# EAGLE design DigitalLevel (EAGLE 9.6.2)
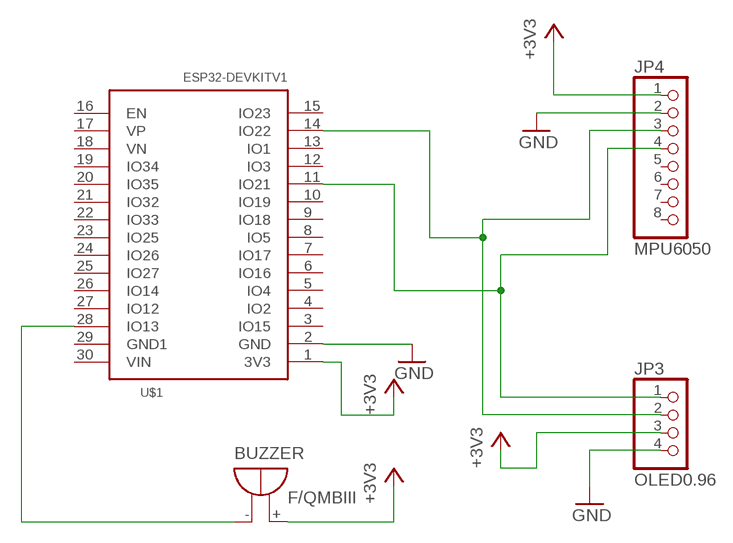
[diagram p0: schematic, sheet 1]

## Parts
BUZZER  F/QMBIII  [F/QMBIII]
JP3  OLED0.96  PINHD-1X4  [1X04]
JP4  MPU6050  PINHD-1X8  [1X08]
U$1  ESP32DEVKITV1  [ESP32-DEVKITV1]

## Nets
+3V3: BUZZER.+(-) JP3.3 JP4.1 U$1.1(3V3)
GND: JP3.4 JP4.2 U$1.2(GND)
N$1: BUZZER.-(+) U$1.28(IO13)
N$3: JP3.1 JP4.4 U$1.11(IO21)
N$4: JP3.2 JP4.3 U$1.14(IO22)
Unconnected: JP4.5 JP4.6 JP4.7 JP4.8 U$1.3(IO15) U$1.4(IO2) U$1.5(IO4) U$1.6(IO16) U$1.7(IO17) U$1.8(IO5) U$1.9(IO18) U$1.10(IO19) U$1.12(IO3) U$1.13(IO1) U$1.15(IO23) U$1.16(EN) U$1.17(VP) U$1.18(VN) U$1.19(IO34) U$1.20(IO35) U$1.21(IO32) U$1.22(IO33) U$1.23(IO25) U$1.24(IO26) U$1.25(IO27) U$1.26(IO14) U$1.27(IO12) U$1.29(GND1) U$1.30(VIN)

## Library data of the parts
BUZZER = buzzer:F/QMBIII: BUZZER Source: Buerklin; OC_FARNELL: unknown; OC_NEWARK: unknown
JP3 = pinhead:PINHD-1X4: PIN HEADER
JP4 = pinhead:PINHD-1X8: PIN HEADER
U$1 = ESP32-DEVKITV1:ESP32DEVKITV1

## Board
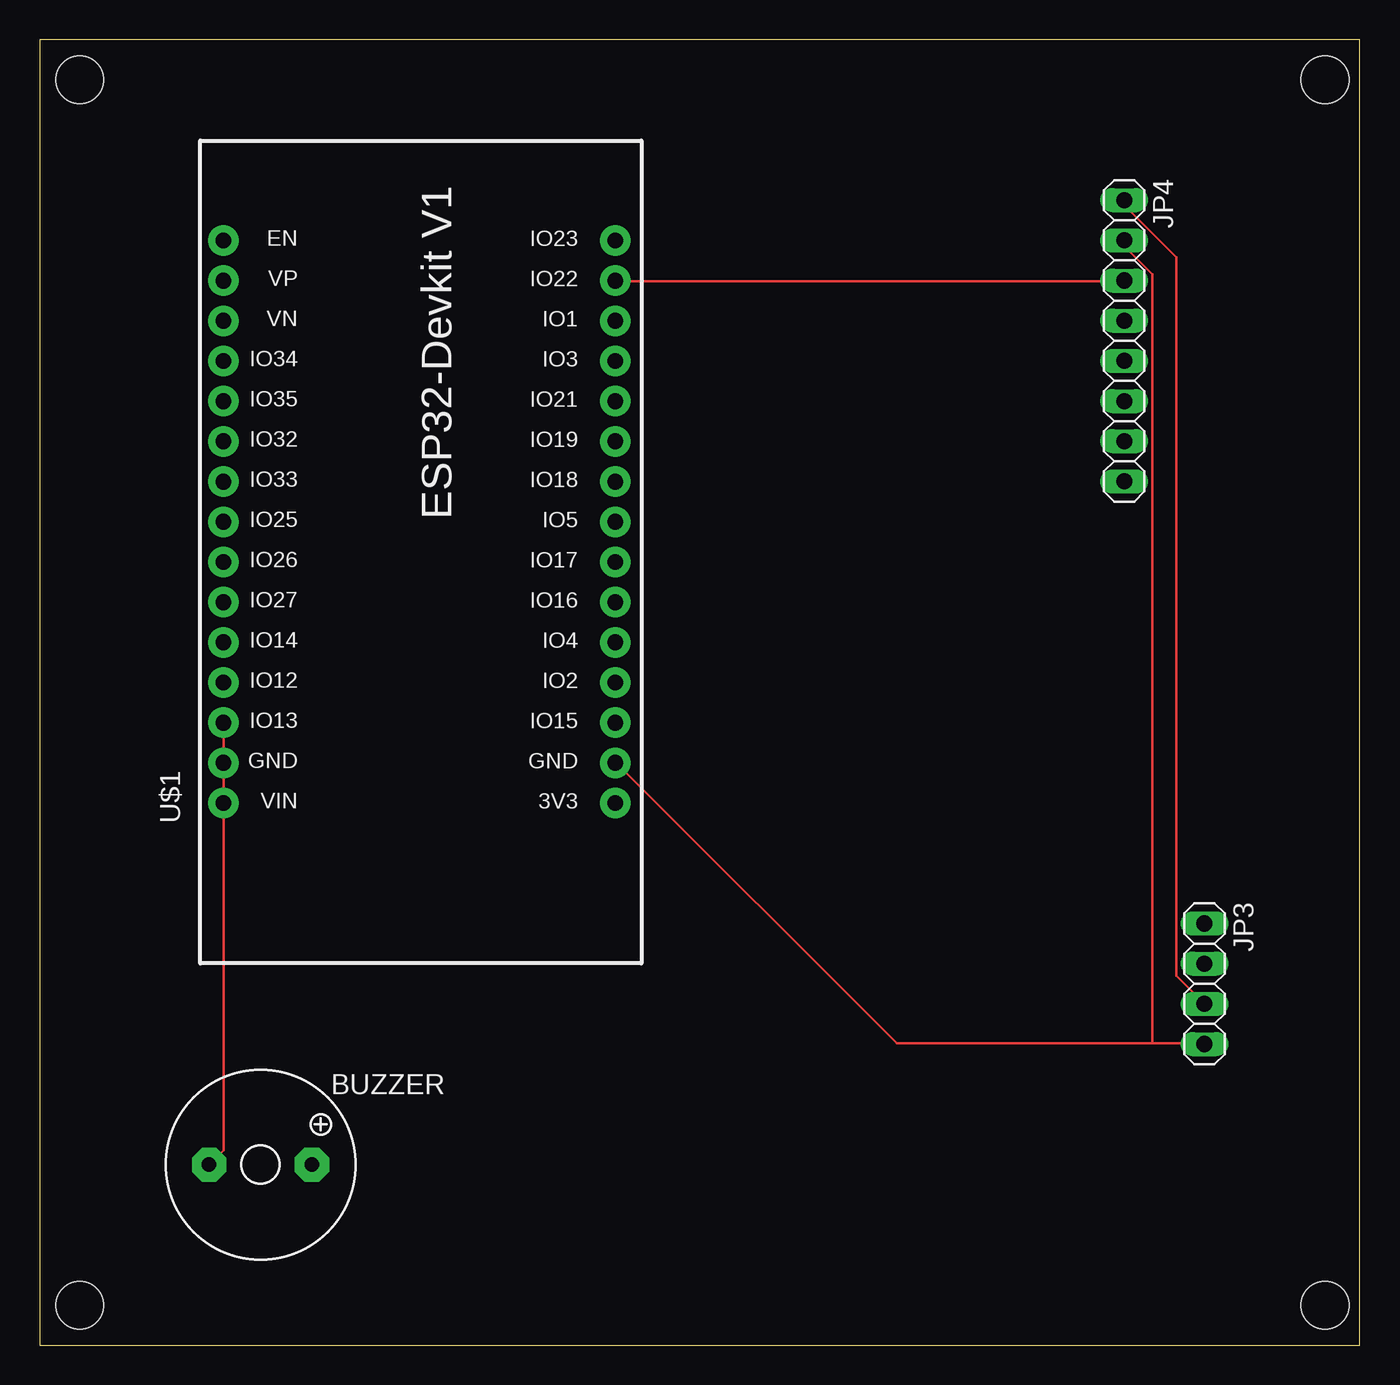
[diagram p1: board, top side]
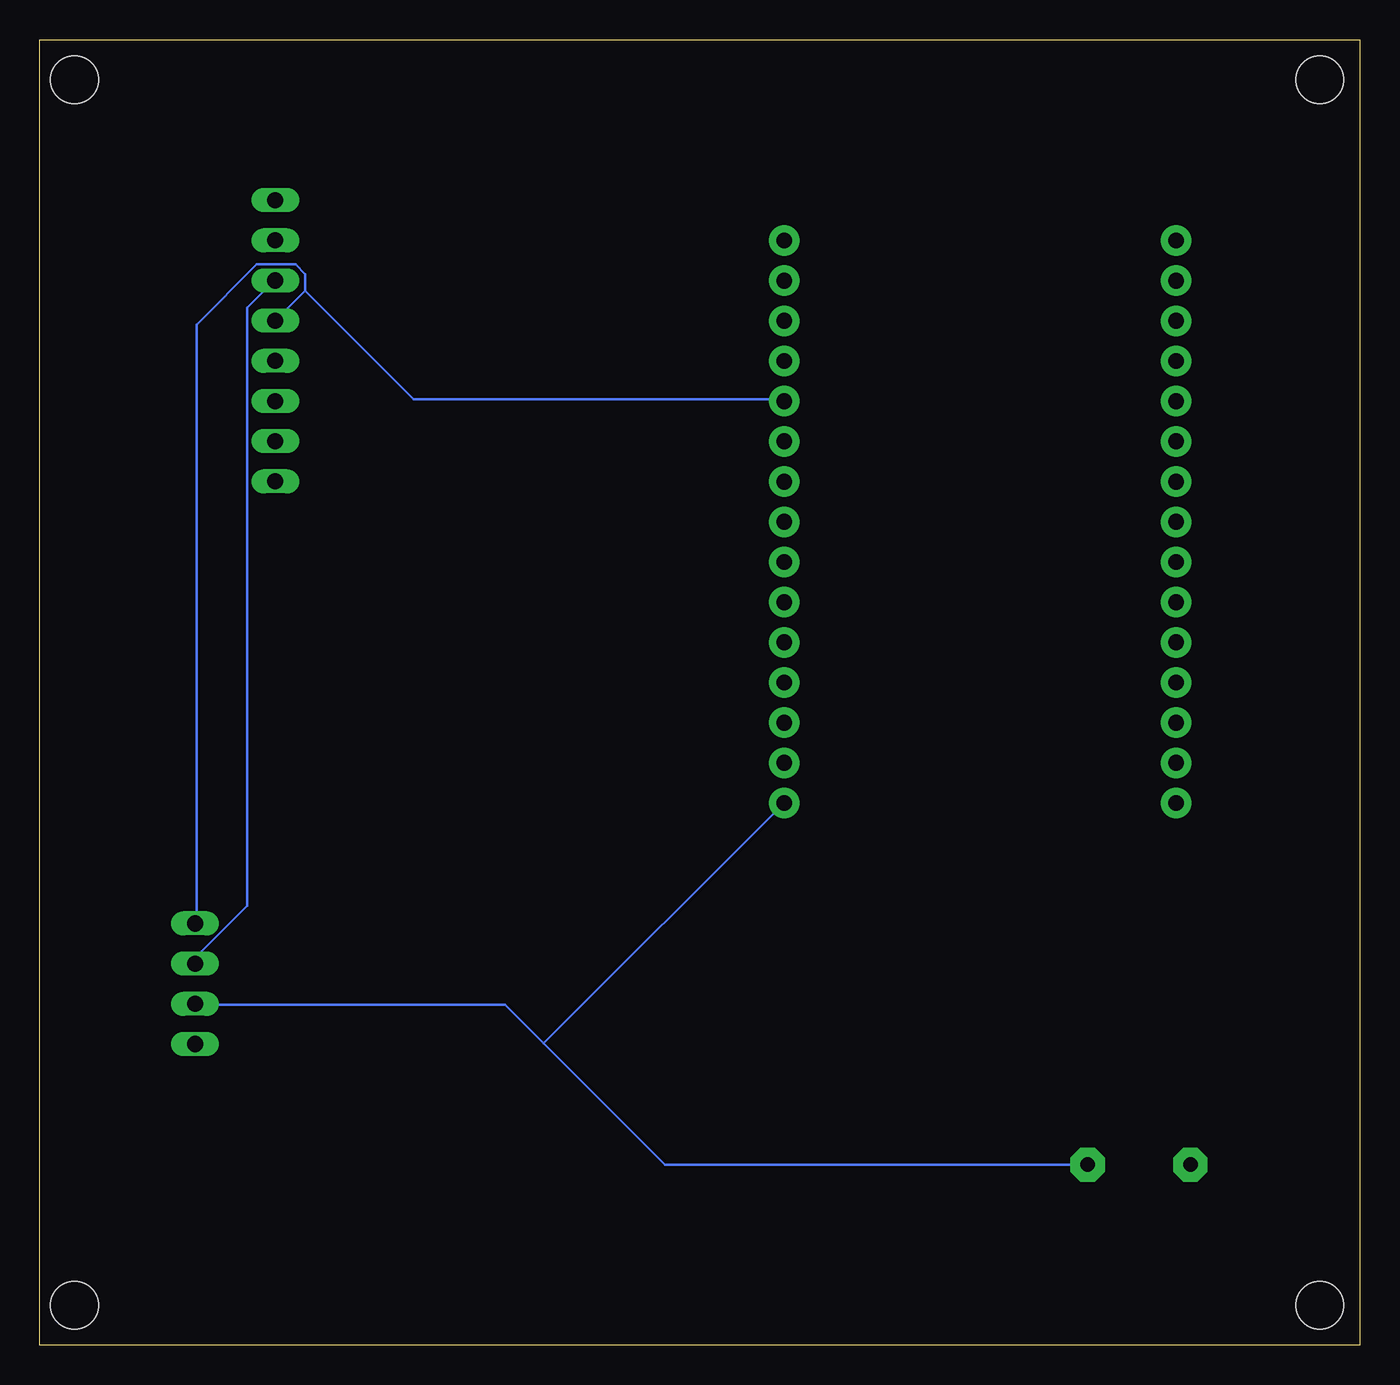
[diagram p2: board, bottom side, seen from below]

Size 83.49 x 82.54 mm. Coordinates in mm from the lower left corner, seen from the top.
Outline: 0,0 83.49,0 83.49,82.54 0,82.54 0,0
Copper layers (1*16): Top 0.035mm / dielectric 1.5mm / Bottom 0.035mm
Design rules "default": minimum track width 6mil, minimum drill 0.35mm, track to track 6mil, track to pad 6mil, pad to pad 6mil, via to via 6mil, smd to smd 6mil, copper to edge 40mil, drill to drill 6mil, minimum pad ring 10mil, minimum via ring 8mil, stop-mask expansion 4mil, vias tented up to drill 0mil, thermal gap 10mil
Holes 3 mm at 2.54,80.01 81.28,80.01 81.28,2.54 2.54,2.54

### Footprints (pad centres in the part's own frame; a part is rotated, then mirrored left to right if it is on the bottom)
F/QMBIII = drill 0.914 pad 2.159 octagon: + 3.251,0; - -3.251,0
1X04 = drill 1.016 long: 1 -3.81,0; 2 -1.27,0; 3 1.27,0; 4 3.81,0
1X08 = drill 1.016 long: 1 -8.89,0; 2 -6.35,0; 3 -3.81,0; 4 -1.27,0; 5 1.27,0; 6 3.81,0; 7 6.35,0; 8 8.89,0
ESP32-DEVKITV1 = drill 1 pad 1.93: 1 -22.87,-13.54; 2 -20.33,-13.54; 3 -17.79,-13.54; 4 -15.25,-13.54; 5 -12.71,-13.54; 6 -10.17,-13.54; 7 -7.63,-13.54; 8 -5.09,-13.54; 9 -2.55,-13.54; 10 -0.01,-13.54; 11 2.53,-13.54; 12 5.07,-13.54; 13 7.61,-13.54; 14 10.15,-13.54; 15 12.69,-13.54; 16 12.69,11.23; 17 10.15,11.23; 18 7.61,11.23; 19 5.07,11.23; 20 2.53,11.23; 21 -0.01,11.23; 22 -2.55,11.23; 23 -5.09,11.23; 24 -7.63,11.23; 25 -10.17,11.23; 26 -12.71,11.23; 27 -15.25,11.23; 28 -17.79,11.23; 29 -20.33,11.23; 30 -22.87,11.23

### Placement (x,y rotation side)
BUZZER  13.97,11.43 0 top
JP3  73.66,22.86 270 top
JP4  68.58,63.5 270 top
U$1  22.86,57.15 90 top

### Tracks (layer width: path | path; a pad name or v marks a point on that pad's centre or on a via)
+3V3
  Top 0.152: JP3.3 71.88,23.37 71.88,68.78 68.68,71.98 68.68,72.29 JP4.1
  Bottom 0.152: 51.61,19.1 43.94,11.43 BUZZER.+ | 51.61,19.1 54.05,21.54 73.56,21.54 JP3.3 | 51.61,19.1 36.52,34.19 U$1.1
GND
  Top 0.152: 70.36,19.1 54.2,19.1 36.52,36.78 U$1.2 | 70.36,19.1 73.56,19.1 JP3.4 | 70.36,19.1 70.36,67.72 68.68,69.39 68.68,69.85 JP4.2
N$1
  Top 0.152: U$1.28 11.63,12.34 BUZZER.-
N$3
  Bottom 0.152: 66.7,66.65 66.7,67.72 67.31,68.33 69.75,68.33 73.56,64.52 73.56,26.72 JP3.1 | JP4.4 66.7,66.65 | 66.7,66.65 59.84,59.79 36.52,59.79 U$1.11
N$4
  Top 0.152: JP4.3 68.53,67.26 36.52,67.26 U$1.14
  Bottom 0.152: JP3.2 73.56,24.13 73.56,24.59 70.36,27.79 70.36,65.58 68.68,67.26 JP4.3